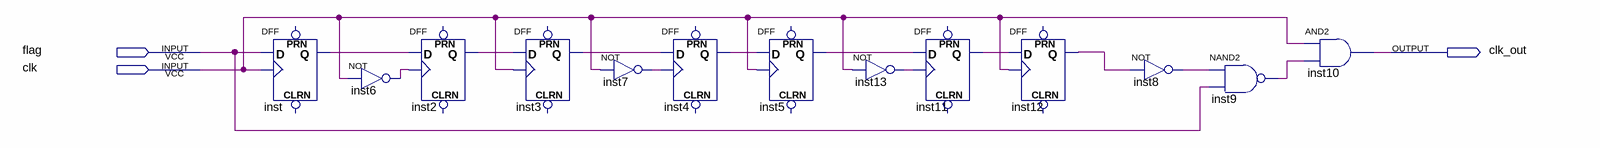
[diagram p0: schematic sheet]
// Quartus schematic CLK_Count2.bdf as structural Verilog: 13 symbols, 3 pins
module CLK_Count2 (
  input  flag,
  input  clk,
  output clk_out
);

  wire inst2_q, inst3_q, inst4_q, inst5_q, inst6_out, inst7_out, inst8_out, inst9_out, inst11_q, inst12_q,
       inst13_out, inst_q;

  DFF inst (.CLK(clk), .D(flag), .Q(inst_q));  // open: CLRN, PRN
  not inst6 (inst6_out, clk);
  DFF inst2 (.CLK(inst6_out), .D(inst_q), .Q(inst2_q));  // open: CLRN, PRN
  DFF inst3 (.CLK(clk), .D(inst2_q), .Q(inst3_q));  // open: CLRN, PRN
  not inst7 (inst7_out, clk);
  DFF inst4 (.CLK(inst7_out), .D(inst3_q), .Q(inst4_q));  // open: CLRN, PRN
  DFF inst5 (.CLK(clk), .D(inst4_q), .Q(inst5_q));  // open: CLRN, PRN
  not inst13 (inst13_out, clk);
  DFF inst11 (.CLK(inst13_out), .D(inst5_q), .Q(inst11_q));  // open: CLRN, PRN
  DFF inst12 (.CLK(clk), .D(inst11_q), .Q(inst12_q));  // open: CLRN, PRN
  not inst8 (inst8_out, inst12_q);
  nand inst9 (inst9_out, inst8_out, flag);
  and inst10 (clk_out, clk, inst9_out);
endmodule
